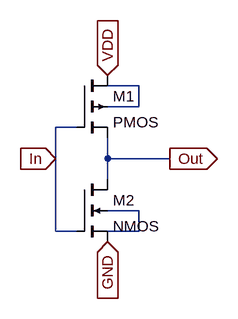
[diagram p0: schematic NOT.asc]
NOT.asc, the LTspice schematic file:
Version 4
SHEET 1 880 680
WIRE 240 80 192 80
WIRE 240 112 240 80
WIRE 240 112 192 112
WIRE 144 144 112 144
WIRE 112 192 112 144
WIRE 192 192 192 160
WIRE 288 192 192 192
WIRE 192 224 192 192
WIRE 240 272 192 272
WIRE 112 304 112 192
WIRE 144 304 112 304
WIRE 240 304 240 272
WIRE 240 304 192 304
FLAG 288 192 Out
IOPIN 288 192 Out
FLAG 112 192 In
IOPIN 112 192 In
FLAG 192 320 GND
IOPIN 192 320 In
FLAG 192 64 VDD
IOPIN 192 64 In
SYMBOL pmos4 144 64 R0
SYMATTR InstName M1
SYMBOL nmos4 144 224 R0
SYMATTR InstName M2

The netlist it stands for:
* NOT.asc
M1 VDD In Out N001 PMOS
M2 Out In GND N002 NMOS
.model NMOS NMOS
.model PMOS PMOS
.lib standard.mos
.backanno
.end